# Altium project FULL_BRIDGE_CONVERTER.PrjPcb (part 3 of 3)
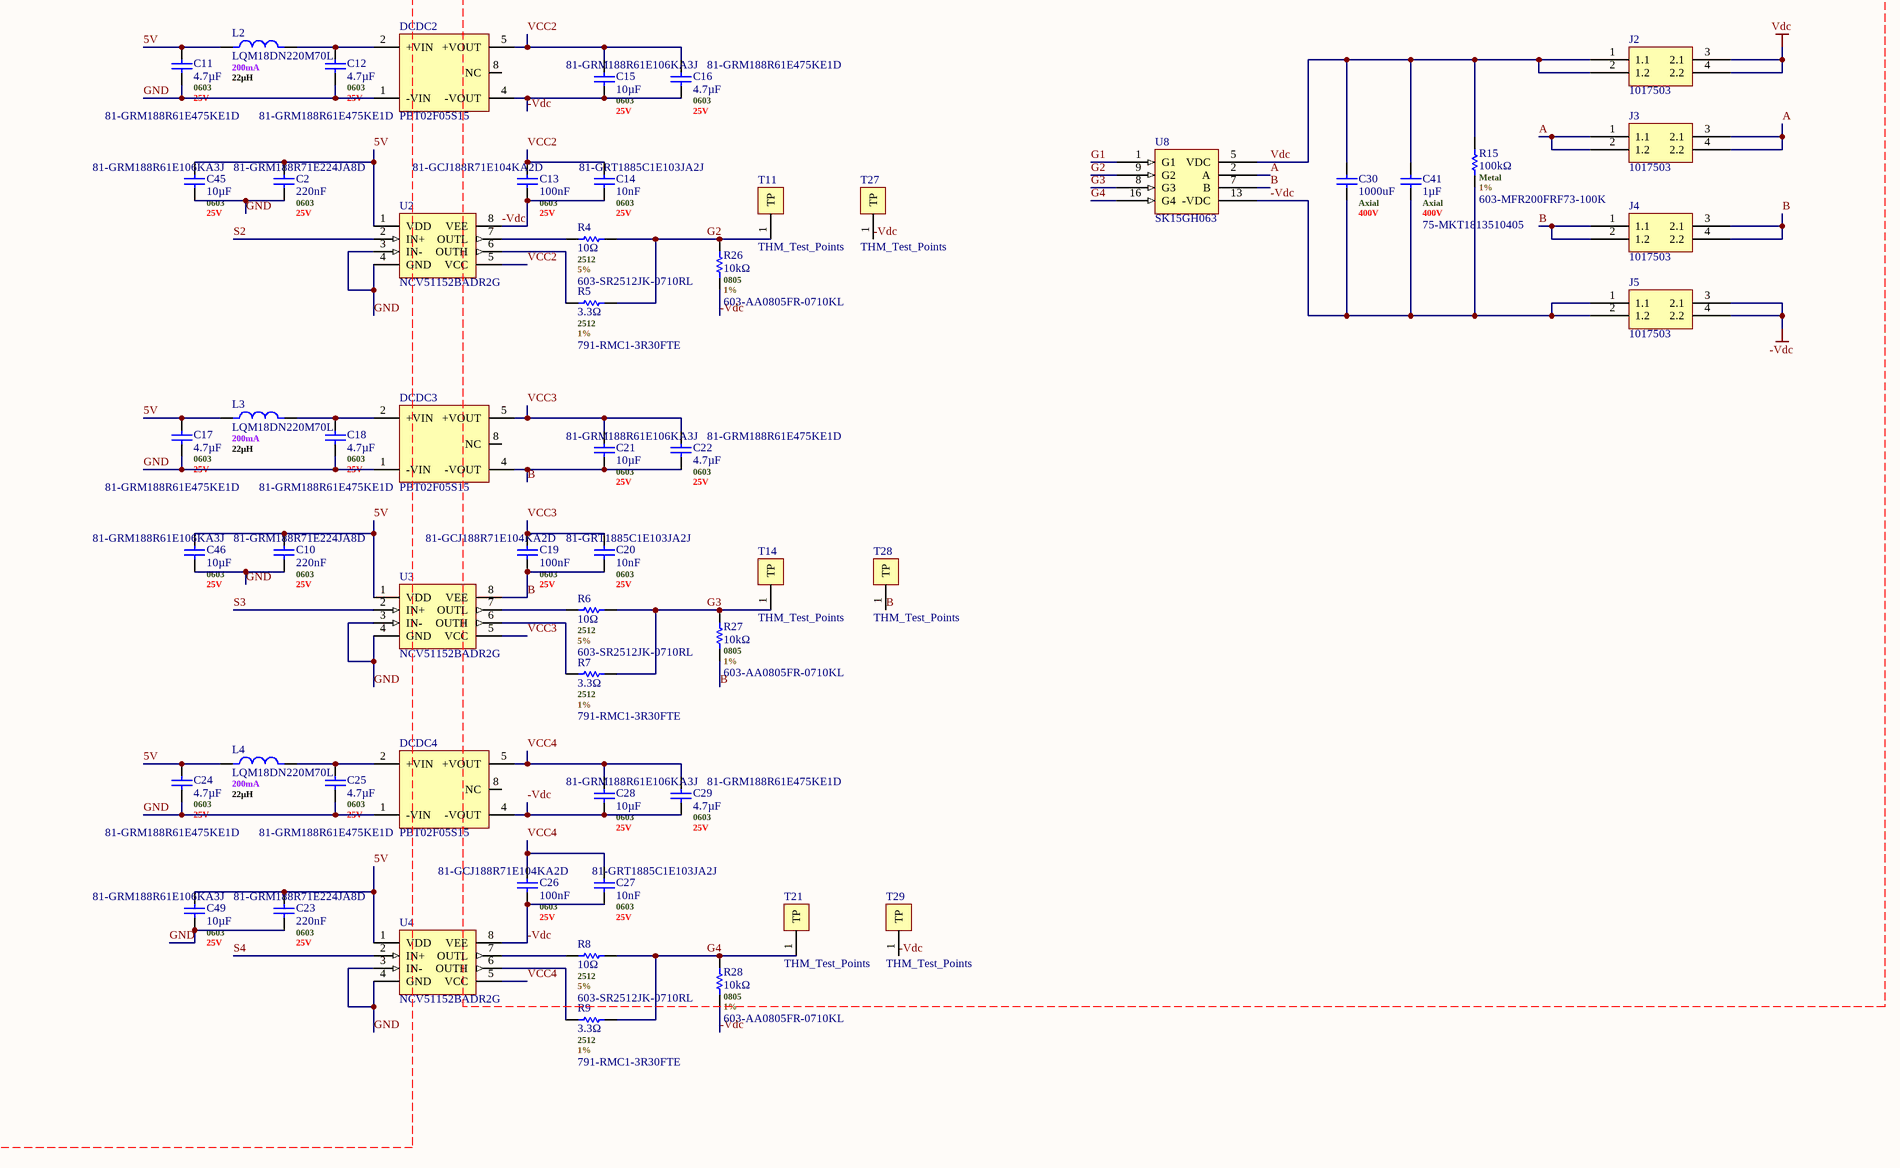
[diagram p5: full_bridge_converter.SchDoc, bottom right]

## Sheet full_bridge_converter.SchDoc (continued)

### Library data of the parts (continued)
R20-R23 = RC0603FR-071KL: Fixed Resistor, Metal Glaze/Thick Film, 0.1W, 1000ohm, 75V, 1% +/-Tol, Surface Mount, 0603; Manufacturer: Yageo Group; Power Dissipation: 100mW; Temperature Coefficient: 100ppm/°C; Voltage Rating: 50V; Supplier 1: Mouser; Manufacturer Part Number: RC0603FR-071KL; RoHS: Compliant; Category: Chip SMD Resistors; Stock 1: 9866215; Pricing 1: 1=0,1, 10=0,007, 50=0,007, 100=0,006, 1000=0,006, 10000=0,002 (USD); Case/Package: 0603; Case Code (Imperial): 0603; Case Code (Metric): 0603; China RoHS: Non-Compliant; Composition: Thick Film; Contact Plating: Tin; Country of Origin: Mainland China, Taiwan; Depth: 800µm; Export Control Classification Number (ECCN) Code: EAR99; Height: 450µm; Harmonized Tariff Schedule (HTS) Code: 8533.21.00.30; Introduction Date: 2004-10-04; Lead Free: Lead Free; Length: 1.6mm; Lifecycle Status: Production; Max Operating Temperature: 155°C; Military Standard: Not; Min Operating Temperature: -55°C; Mount: Surface Mount; Number of Pins: 2; Number of Terminals: 2; Packaging: Tape and Reel; Power Rating: 100mW; Radiation Hardening: No; REACH SVHC: Yes; Resistance: 1kΩ; Schedule B: 8533210045, 8533210045|8533210045|8533210045|8533210045|8533210045|8533210045|8533210045|8533210045|8533210045|8533210045|8533210045|8533210045|8533210045|8533210045|8533210045|8533210045|8533210045|8533210045|8533210045|8533210045|8533210045|8533210045|8533210045|85; Termination: SMD/SMT; Tolerance: 1%; Voltage Rating (DC): 50V; Width: 800µm; Working Voltage: 75V; ComponentLink1URL: https://datasheet.octopart.com:443/RC0603FR-071KL-Yageo-datasheet-175887523.pdf?src-supplier=Newark; ComponentLink1Description: https://datasheet.octopart.com:443/RC0603FR-071KL-Yageo-datasheet-175887523.pdf?src-supplier=Newark; ComponentLink2URL: https://datasheet.octopart.com:443/RC0603FR-071KL-Yageo-datasheet-34211833.pdf?src-supplier=Newark; ComponentLink2Description: https://datasheet.octopart.com:443/RC0603FR-071KL-Yageo-datasheet-34211833.pdf?src-supplier=Newark; ComponentLink3URL: https://datasheet.octopart.com:443/RC0603FR-071KL-Yageo-datasheet-12596169.pdf?src-supplier=Newark; ComponentLink3Description: https://datasheet.octopart.com:443/RC0603FR-071KL-Yageo-datasheet-12596169.pdf?src-supplier=Newark; ComponentLink4URL: https://datasheet.octopart.com:443/RC0603FR-071KL-Yageo-datasheet-499455.pdf?src-supplier=Newark; ComponentLink4Description: https://datasheet.octopart.com:443/RC0603FR-071KL-Yageo-datasheet-499455.pdf?src-supplier=Newark; ComponentLink5URL: https://datasheet.octopart.com:443/RC0603FR-071KL-Yageo-datasheet-503470.pdf?src-supplier=Newark; ComponentLink5Description: https://datasheet.octopart.com:443/RC0603FR-071KL-Yageo-datasheet-503470.pdf?src-supplier=Newark; ComponentLink6URL: https://datasheet.octopart.com:443/RC0603FR-071KL-Yageo-datasheet-62067350.pdf?src-supplier=element14+APAC; ComponentLink6Description: https://datasheet.octopart.com:443/RC0603FR-071KL-Yageo-datasheet-62067350.pdf?src-supplier=element14+APAC; ComponentLink7URL: https://datasheet.octopart.com:443/RC0603FR-071KL-Yageo-datasheet-21426514.pdf?src-supplier=element14+APAC; ComponentLink7Description: https://datasheet.octopart.com:443/RC0603FR-071KL-Yageo-datasheet-21426514.pdf?src-supplier=element14+APAC; ComponentLink8URL: https://datasheet.octopart.com:443/RC0603FR-071KL-Yageo-datasheet-141265859.pdf?src-supplier=Upverter; ComponentLink8Description: https://datasheet.octopart.com:443/RC0603FR-071KL-Yageo-datasheet-141265859.pdf?src-supplier=Upverter; ComponentLink9URL: https://datasheet.octopart.com:443/RC0603FR-071KL-Yageo-datasheet-103092701.pdf?src-supplier=Upverter; ComponentLink9Description: https://datasheet.octopart.com:443/RC0603FR-071KL-Yageo-datasheet-103092701.pdf?src-supplier=Upverter; ComponentLink10URL: https://sigma.octopart.com:443/138820526/technical_drawing/Yageo-RC0603FR-071KL.pdf?src-supplier=Upverter; ComponentLink10Description: https://sigma.octopart.com:443/138820526/technical_drawing/Yageo-RC0603FR-071KL.pdf?src-supplier=Upverter; ComponentLink11URL: https://datasheet.octopart.com:443/RC0603FR-071KL-Yageo-datasheet-68297981.pdf?src-supplier=Upverter; ComponentLink11Description: https://datasheet.octopart.com:443/RC0603FR-071KL-Yageo-datasheet-68297981.pdf?src-supplier=Upverter; ComponentLink12URL: https://datasheet.octopart.com:443/RC0603FR-071KL-Yageo-datasheet-8328172.pdf?src-supplier=Farnell; ComponentLink12Description: https://datasheet.octopart.com:443/RC0603FR-071KL-Yageo-datasheet-8328172.pdf?src-supplier=Farnell; ComponentLink13URL: https://datasheet.octopart.com:443/RC0603FR-071KL-Yageo-datasheet-13691069.pdf?src-supplier=Farnell; ComponentLink13Description: https://datasheet.octopart.com:443/RC0603FR-071KL-Yageo-datasheet-13691069.pdf?src-supplier=Farnell; ComponentLink14URL: https://datasheet.octopart.com:443/RC0603FR-071KL-Yageo-datasheet-15599030.pdf?src-supplier=Seeed+Studio; ComponentLink14Description: https://datasheet.octopart.com:443/RC0603FR-071KL-Yageo-datasheet-15599030.pdf?src-supplier=Seeed+Studio; ComponentLink15URL: https://datasheet.octopart.com:443/RC0603FR-071KL-Yageo-Group-datasheet-176638170.pdf?src-supplier=Future+Electronics; ComponentLink15Description: https://datasheet.octopart.com:443/RC0603FR-071KL-Yageo-Group-datasheet-176638170.pdf?src-supplier=Future+Electronics; ComponentLink16URL: https://datasheet.octopart.com:443/RC0603FR-071KL-Yageo-datasheet-164759695.pdf?src-supplier=Future+Electronics; ComponentLink16Description: https://datasheet.octopart.com:443/RC0603FR-071KL-Yageo-datasheet-164759695.pdf?src-supplier=Future+Electronics; ComponentLink17URL: https://datasheet.octopart.com:443/RC0603FR-071KL-Yageo-datasheet-137700087.pdf?src-supplier=Future+Electronics; ComponentLink17Description: https://datasheet.octopart.com:443/RC0603FR-071KL-Yageo-datasheet-137700087.pdf?src-supplier=Future+Electronics; ComponentLink18URL: https://datasheet.octopart.com:443/RC0603FR071KL-Yageo-datasheet-27584510.pdf?src-supplier=Future+Electronics; ComponentLink18Description: https://datasheet.octopart.com:443/RC0603FR071KL-Yageo-datasheet-27584510.pdf?src-supplier=Future+Electronics; ComponentLink19URL: https://datasheet.octopart.com:443/RC0603FR-071KL-Yageo-datasheet-8324193.pdf?src-supplier=Future+Electronics; ComponentLink19Description: https://datasheet.octopart.com:443/RC0603FR-071KL-Yageo-datasheet-8324193.pdf?src-supplier=Future+Electronics; ComponentLink20URL: https://datasheet.octopart.com:443/RC0603FR-071KL-Yageo-datasheet-79472498.pdf?src-supplier=Megastar; ComponentLink20Description: https://datasheet.octopart.com:443/RC0603FR-071KL-Yageo-datasheet-79472498.pdf?src-supplier=Megastar; ComponentLink21URL: https://datasheet.octopart.com/RC0603FR-071KL-Yageo-datasheet-73766026.pdf; ComponentLink21Description: https://datasheet.octopart.com/RC0603FR-071KL-Yageo-datasheet-73766026.pdf; ComponentLink22URL: https://datasheet.octopart.com:443/RC0603FR-071KL-Yageo-datasheet-118562.pdf?src-supplier=DigiKey; ComponentLink22Description: https://datasheet.octopart.com:443/RC0603FR-071KL-Yageo-datasheet-118562.pdf?src-supplier=DigiKey; ComponentLink23URL: http://sigma.octopart.com:80/conflict_mineral_statement/Yageo-company-3.pdf?src-supplier=Compliance+Statements; ComponentLink23Description: http://sigma.octopart.com:80/conflict_mineral_statement/Yageo-company-3.pdf?src-supplier=Compliance+Statements; ComponentLink24URL: http://sigma.octopart.com:80/rohs_statement/Yageo-company-2.pdf?src-supplier=Compliance+Statements; ComponentLink24Description: http://sigma.octopart.com:80/rohs_statement/Yageo-company-2.pdf?src-supplier=Compliance+Statements
R25-R28 = AA0805FR-0710KL: Fixed Resistor, Metal Glaze/thick Film, 0.125W, 10000ohm, 150V, 1% +/-Tol, 150ppm/Cel, Surface Mount, 0805; Manufacturer: Yageo Group; Power Dissipation: 125mW; Temperature Coefficient: 100ppm/°C; Supplier 1: Mouser; Manufacturer Part Number: AA0805FR-0710KL; RoHS: Compliant; Category: Chip SMD Resistors; Stock 1: 25236; Pricing 1: 1=0,1, 10=0,010, 50=0,010, 100=0,006, 1000=0,006, 10000=0,004 (USD); Case/Package: 0805; Case Code (Imperial): 0805; Case Code (Metric): 2012; China RoHS: Non-Compliant; Composition: Thick Film; Contact Plating: Tin; Country of Origin: Mainland China, Taiwan; Depth: 1.25mm; Export Control Classification Number (ECCN) Code: EAR99; Height: 500µm; Harmonized Tariff Schedule (HTS) Code: 8533.21.00.30; Introduction Date: 2004-09-22; Length: 2mm; Lifecycle Status: Production; Max Operating Temperature: 155°C; Military Standard: Not; Min Operating Temperature: -55°C; Mount: Surface Mount; Number of Pins: 2; Number of Terminals: 2; Packaging: Tape & Reel; Power Rating: 125mW; Radiation Hardening: No; REACH SVHC: Yes; Resistance: 10kΩ; Schedule B: 8533210045; Termination: SMD/SMT; Tolerance: 1%; Voltage Rating: 150V; Voltage Rating (DC): 150V; Width: 1.25mm; Working Voltage: 150V; ComponentLink1URL: https://datasheet.octopart.com:443/RC0805JR-101KL-Yageo-datasheet-175887523.pdf?src-supplier=IHS; ComponentLink1Description: https://datasheet.octopart.com:443/RC0805JR-101KL-Yageo-datasheet-175887523.pdf?src-supplier=IHS; ComponentLink2URL: https://datasheet.octopart.com:443/RC0805JR-101KL-Yageo-datasheet-8330313.pdf?src-supplier=element14+APAC; ComponentLink2Description: https://datasheet.octopart.com:443/RC0805JR-101KL-Yageo-datasheet-8330313.pdf?src-supplier=element14+APAC; ComponentLink3URL: https://datasheet.octopart.com/RC0805JR-101KL-Yageo-datasheet-73766026.pdf; ComponentLink3Description: https://datasheet.octopart.com/RC0805JR-101KL-Yageo-datasheet-73766026.pdf; ComponentLink4URL: http://sigma.octopart.com:80/conflict_mineral_statement/Yageo-company-3.pdf?src-supplier=Compliance+Statements; ComponentLink4Description: http://sigma.octopart.com:80/conflict_mineral_statement/Yageo-company-3.pdf?src-supplier=Compliance+Statements; ComponentLink5URL: http://sigma.octopart.com:80/rohs_statement/Yageo-company-2.pdf?src-supplier=Compliance+Statements; ComponentLink5Description: http://sigma.octopart.com:80/rohs_statement/Yageo-company-2.pdf?src-supplier=Compliance+Statements; Supplier 2: Mouser; Stock 2: 14567; Pricing 2: 1=0,1, 10=0,015, 50=0,015, 100=0,015, 1000=0,015, 10000=0,012 (USD); Features: Anti-Sulfur, Automotive AEC-Q200, Moisture Resistant; Max Power Dissipation: 125mW; Number of Terminations: 2; ComponentLink6URL: https://datasheet.octopart.com:443/AA0805FR-0710KL-Yageo-datasheet-178056446.pdf?src-supplier=IHS; ComponentLink6Description: https://datasheet.octopart.com:443/AA0805FR-0710KL-Yageo-datasheet-178056446.pdf?src-supplier=IHS